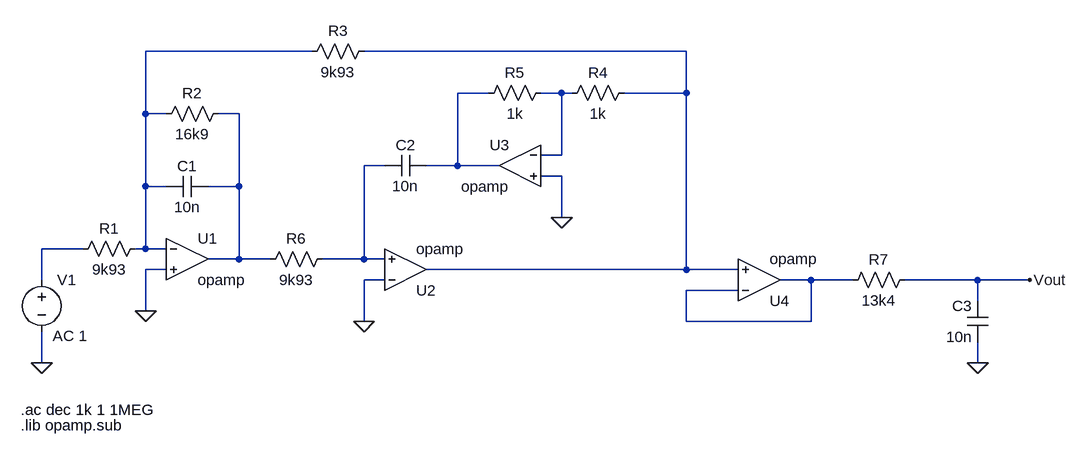
[diagram p0: schematic TPL1.asc]
TPL1.asc, the LTspice schematic file:
Version 4.1
SHEET 1 1276 680
WIRE 96 -160 -160 -160
WIRE 672 -160 176 -160
WIRE 368 -96 320 -96
WIRE 480 -96 448 -96
WIRE 496 -96 480 -96
WIRE 672 -96 672 -160
WIRE 672 -96 576 -96
WIRE -160 -64 -160 -160
WIRE -128 -64 -160 -64
WIRE -16 -64 -48 -64
WIRE 480 0 480 -96
WIRE 480 0 448 0
WIRE 208 16 176 16
WIRE 320 16 320 -96
WIRE 320 16 272 16
WIRE 384 16 320 16
WIRE 480 32 448 32
WIRE -160 48 -160 -64
WIRE -128 48 -160 48
WIRE -16 48 -16 -64
WIRE -16 48 -64 48
WIRE 480 96 480 32
WIRE -256 144 -320 144
WIRE -160 144 -160 48
WIRE -160 144 -176 144
WIRE -128 144 -160 144
WIRE -16 160 -16 48
WIRE -16 160 -64 160
WIRE 32 160 -16 160
WIRE 176 160 176 16
WIRE 176 160 112 160
WIRE 208 160 176 160
WIRE -128 176 -160 176
WIRE 672 176 672 -96
WIRE 672 176 272 176
WIRE 752 176 672 176
WIRE -320 192 -320 144
WIRE 208 192 176 192
WIRE 864 192 816 192
WIRE 928 192 864 192
WIRE 1120 192 1008 192
WIRE 1200 192 1120 192
WIRE 752 208 672 208
WIRE 1120 224 1120 192
WIRE -160 240 -160 176
WIRE 176 256 176 192
WIRE 672 256 672 208
WIRE 864 256 864 192
WIRE 864 256 672 256
WIRE -320 320 -320 272
WIRE 1120 320 1120 288
FLAG -320 320 0
FLAG -160 240 0
FLAG 176 256 0
FLAG 480 96 0
FLAG 1200 192 Vout
FLAG 1120 320 0
SYMBOL OpAmps\\opamp -96 96 R0
SYMATTR InstName U1
SYMBOL voltage -320 176 R0
WINDOW 123 17 102 Left 2
WINDOW 39 0 0 Left 0
SYMATTR Value2 AC 1
SYMATTR InstName V1
SYMATTR Value ""
SYMBOL OpAmps\\opamp 240 240 M180
SYMATTR InstName U2
SYMBOL OpAmps\\opamp 416 -48 M0
SYMATTR InstName U3
SYMBOL res -160 128 R90
WINDOW 0 0 56 VBottom 2
WINDOW 3 32 56 VTop 2
SYMATTR InstName R1
SYMATTR Value 9k93
SYMBOL res -32 -80 R90
WINDOW 0 0 56 VBottom 2
WINDOW 3 32 56 VTop 2
SYMATTR InstName R2
SYMATTR Value 16k9
SYMBOL cap -64 32 R90
WINDOW 0 0 32 VBottom 2
WINDOW 3 32 32 VTop 2
SYMATTR InstName C1
SYMATTR Value 10n
SYMBOL res 192 -176 R90
WINDOW 0 0 56 VBottom 2
WINDOW 3 32 56 VTop 2
SYMATTR InstName R3
SYMATTR Value 9k93
SYMBOL res 592 -112 R90
WINDOW 0 0 56 VBottom 2
WINDOW 3 32 56 VTop 2
SYMATTR InstName R4
SYMATTR Value 1k
SYMBOL res 464 -112 R90
WINDOW 0 0 56 VBottom 2
WINDOW 3 32 56 VTop 2
SYMATTR InstName R5
SYMATTR Value 1k
SYMBOL cap 272 0 R90
WINDOW 0 0 32 VBottom 2
WINDOW 3 32 32 VTop 2
SYMATTR InstName C2
SYMATTR Value 10n
SYMBOL res 128 144 R90
WINDOW 0 0 56 VBottom 2
WINDOW 3 32 56 VTop 2
SYMATTR InstName R6
SYMATTR Value 9k93
SYMBOL OpAmps\\opamp 784 256 M180
SYMATTR InstName U4
SYMBOL res 1024 176 R90
WINDOW 0 0 56 VBottom 2
WINDOW 3 32 56 VTop 2
SYMATTR InstName R7
SYMATTR Value 13k4
SYMBOL cap 1136 288 R180
WINDOW 0 24 56 Left 2
WINDOW 3 24 8 Left 2
SYMATTR InstName C3
SYMATTR Value 10n
TEXT -352 392 Left 2 !.ac dec 1k 1 1MEG
TEXT -352 416 Left 2 !.lib opamp.sub

The netlist it stands for:
* TPL1.asc
X§U1 N001 0 N005 opamp Aol=100K GBW=10Meg  ; pins invin noninvin out
V1 N007 0 AC 1
X§U2 0 N006 N002 opamp Aol=100K GBW=10Meg  ; pins invin noninvin out
X§U3 N004 0 N003 opamp Aol=100K GBW=10Meg  ; pins invin noninvin out
R1 N001 N007 9k93
R2 N005 N001 16k9
C1 N005 N001 10n
R3 N002 N001 9k93
R4 N002 N004 1k
R5 N004 N003 1k
C2 N003 N006 10n
R6 N006 N005 9k93
X§U4 N008 N002 N008 opamp Aol=100K GBW=10Meg  ; pins invin noninvin out
R7 Vout N008 13k4
C3 0 Vout 10n
.ac dec 1k 1 1MEG
.lib opamp.sub
.backanno
.end